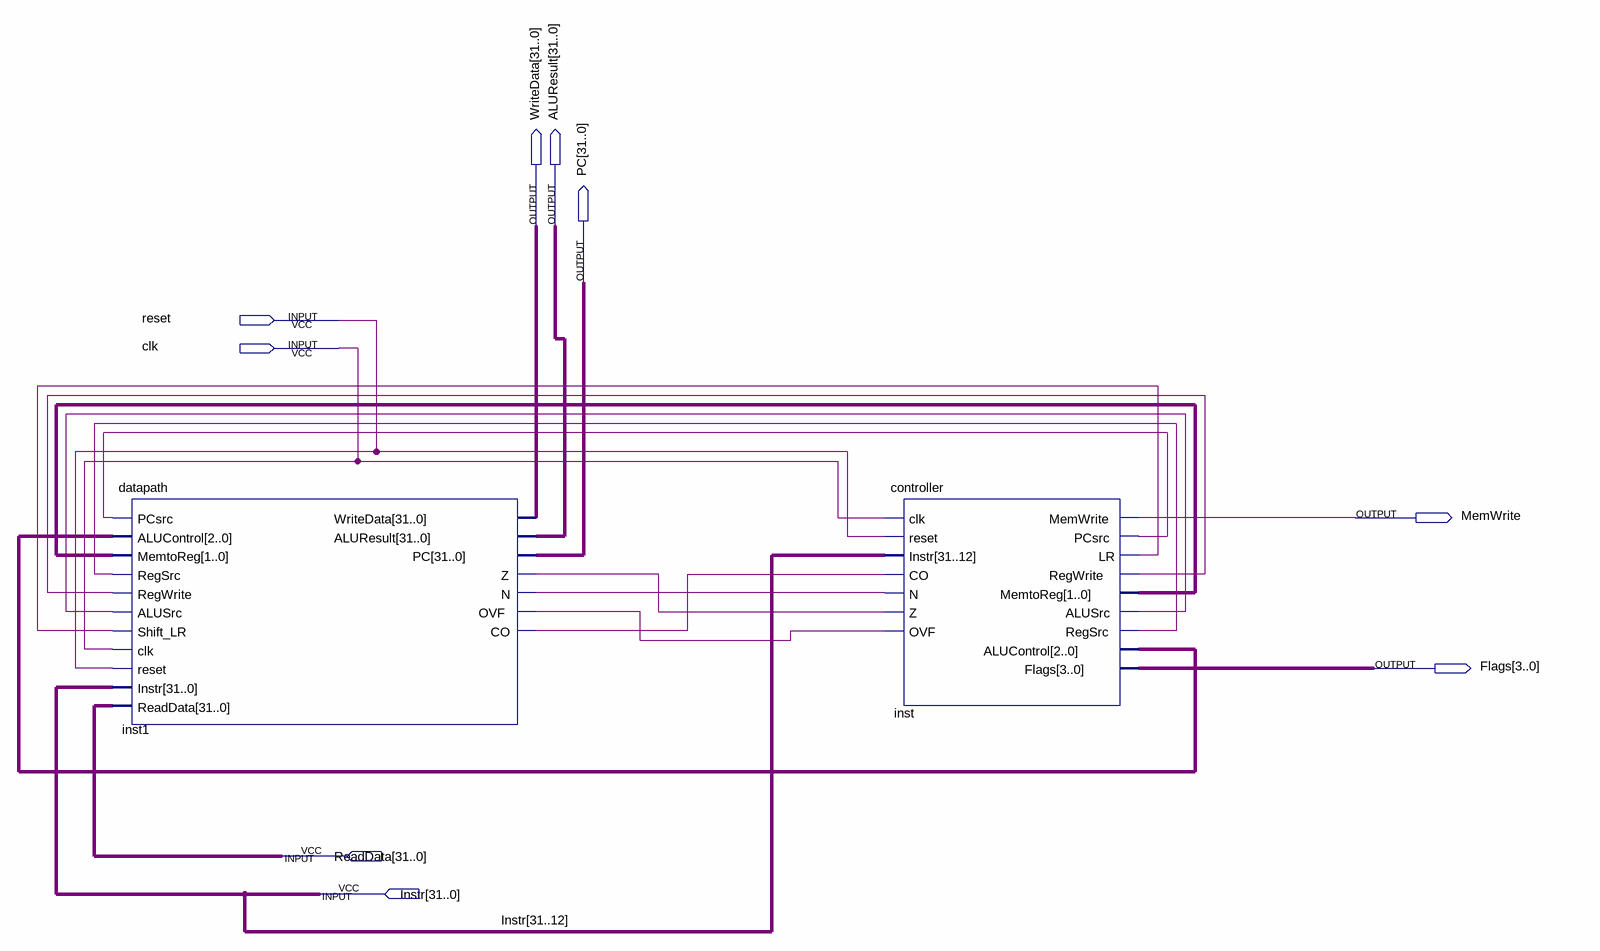
[diagram p0: schematic sheet]
// Quartus schematic arm.bdf as structural Verilog: 2 symbols, 9 pins
module arm (
  input  reset,
  input  clk,
  input  [31:0] ReadData,
  input  [31:0] Instr,
  output [31:0] WriteData,
  output [31:0] ALUResult,
  output [31:0] PC,
  output MemWrite,
  output [3:0] Flags
);

  wire inst1_co, inst1_n, inst1_ovf, inst1_z, inst_alusrc, inst_lr, inst_pcsrc, inst_regsrc, inst_regwrite;
  wire [1:0] inst_memtoreg;
  wire [2:0] inst_alucontrol;

  datapath inst1 (
    .PCsrc(inst_pcsrc), .ALUControl(inst_alucontrol), .MemtoReg(inst_memtoreg), .RegSrc(inst_regsrc),
    .RegWrite(inst_regwrite), .ALUSrc(inst_alusrc), .Shift_LR(inst_lr), .clk(clk), .reset(reset),
    .Instr(Instr), .ReadData(ReadData), .WriteData(WriteData), .ALUResult(ALUResult), .PC(PC), .Z(inst1_z),
    .N(inst1_n), .OVF(inst1_ovf), .CO(inst1_co));
  controller inst (
    .clk(clk), .reset(reset), .Instr(Instr[31:12]), .CO(inst1_co), .N(inst1_n), .Z(inst1_z), .OVF(inst1_ovf),
    .MemWrite(MemWrite), .PCsrc(inst_pcsrc), .LR(inst_lr), .RegWrite(inst_regwrite),
    .MemtoReg(inst_memtoreg), .ALUSrc(inst_alusrc), .RegSrc(inst_regsrc), .ALUControl(inst_alucontrol),
    .Flags(Flags));
endmodule
